# Altium project LPCB235__RLOOP__FCU.PrjPCB (part 4 of 7)

## Sheet LPCB235 - SPI UART - GROUP A.SchDoc
size A3; Address1: Factory 10; Address2: 9-13 Dingley Avenue, Dandeong, VICTORIA 3175, AUSTRALIA; DocumentNumber: 32; Revision: 1; SheetNumber: 32; SheetTotal: 37; Lockie__PCB_SUB_ASSEMBLY: SPI UARTS A; Lockie__PCB_ASSEMBLY: FCU PCB; Lockie__LDL: LPCB235; Lockie__PCB_DESCRIPTION: Flight Control Unit
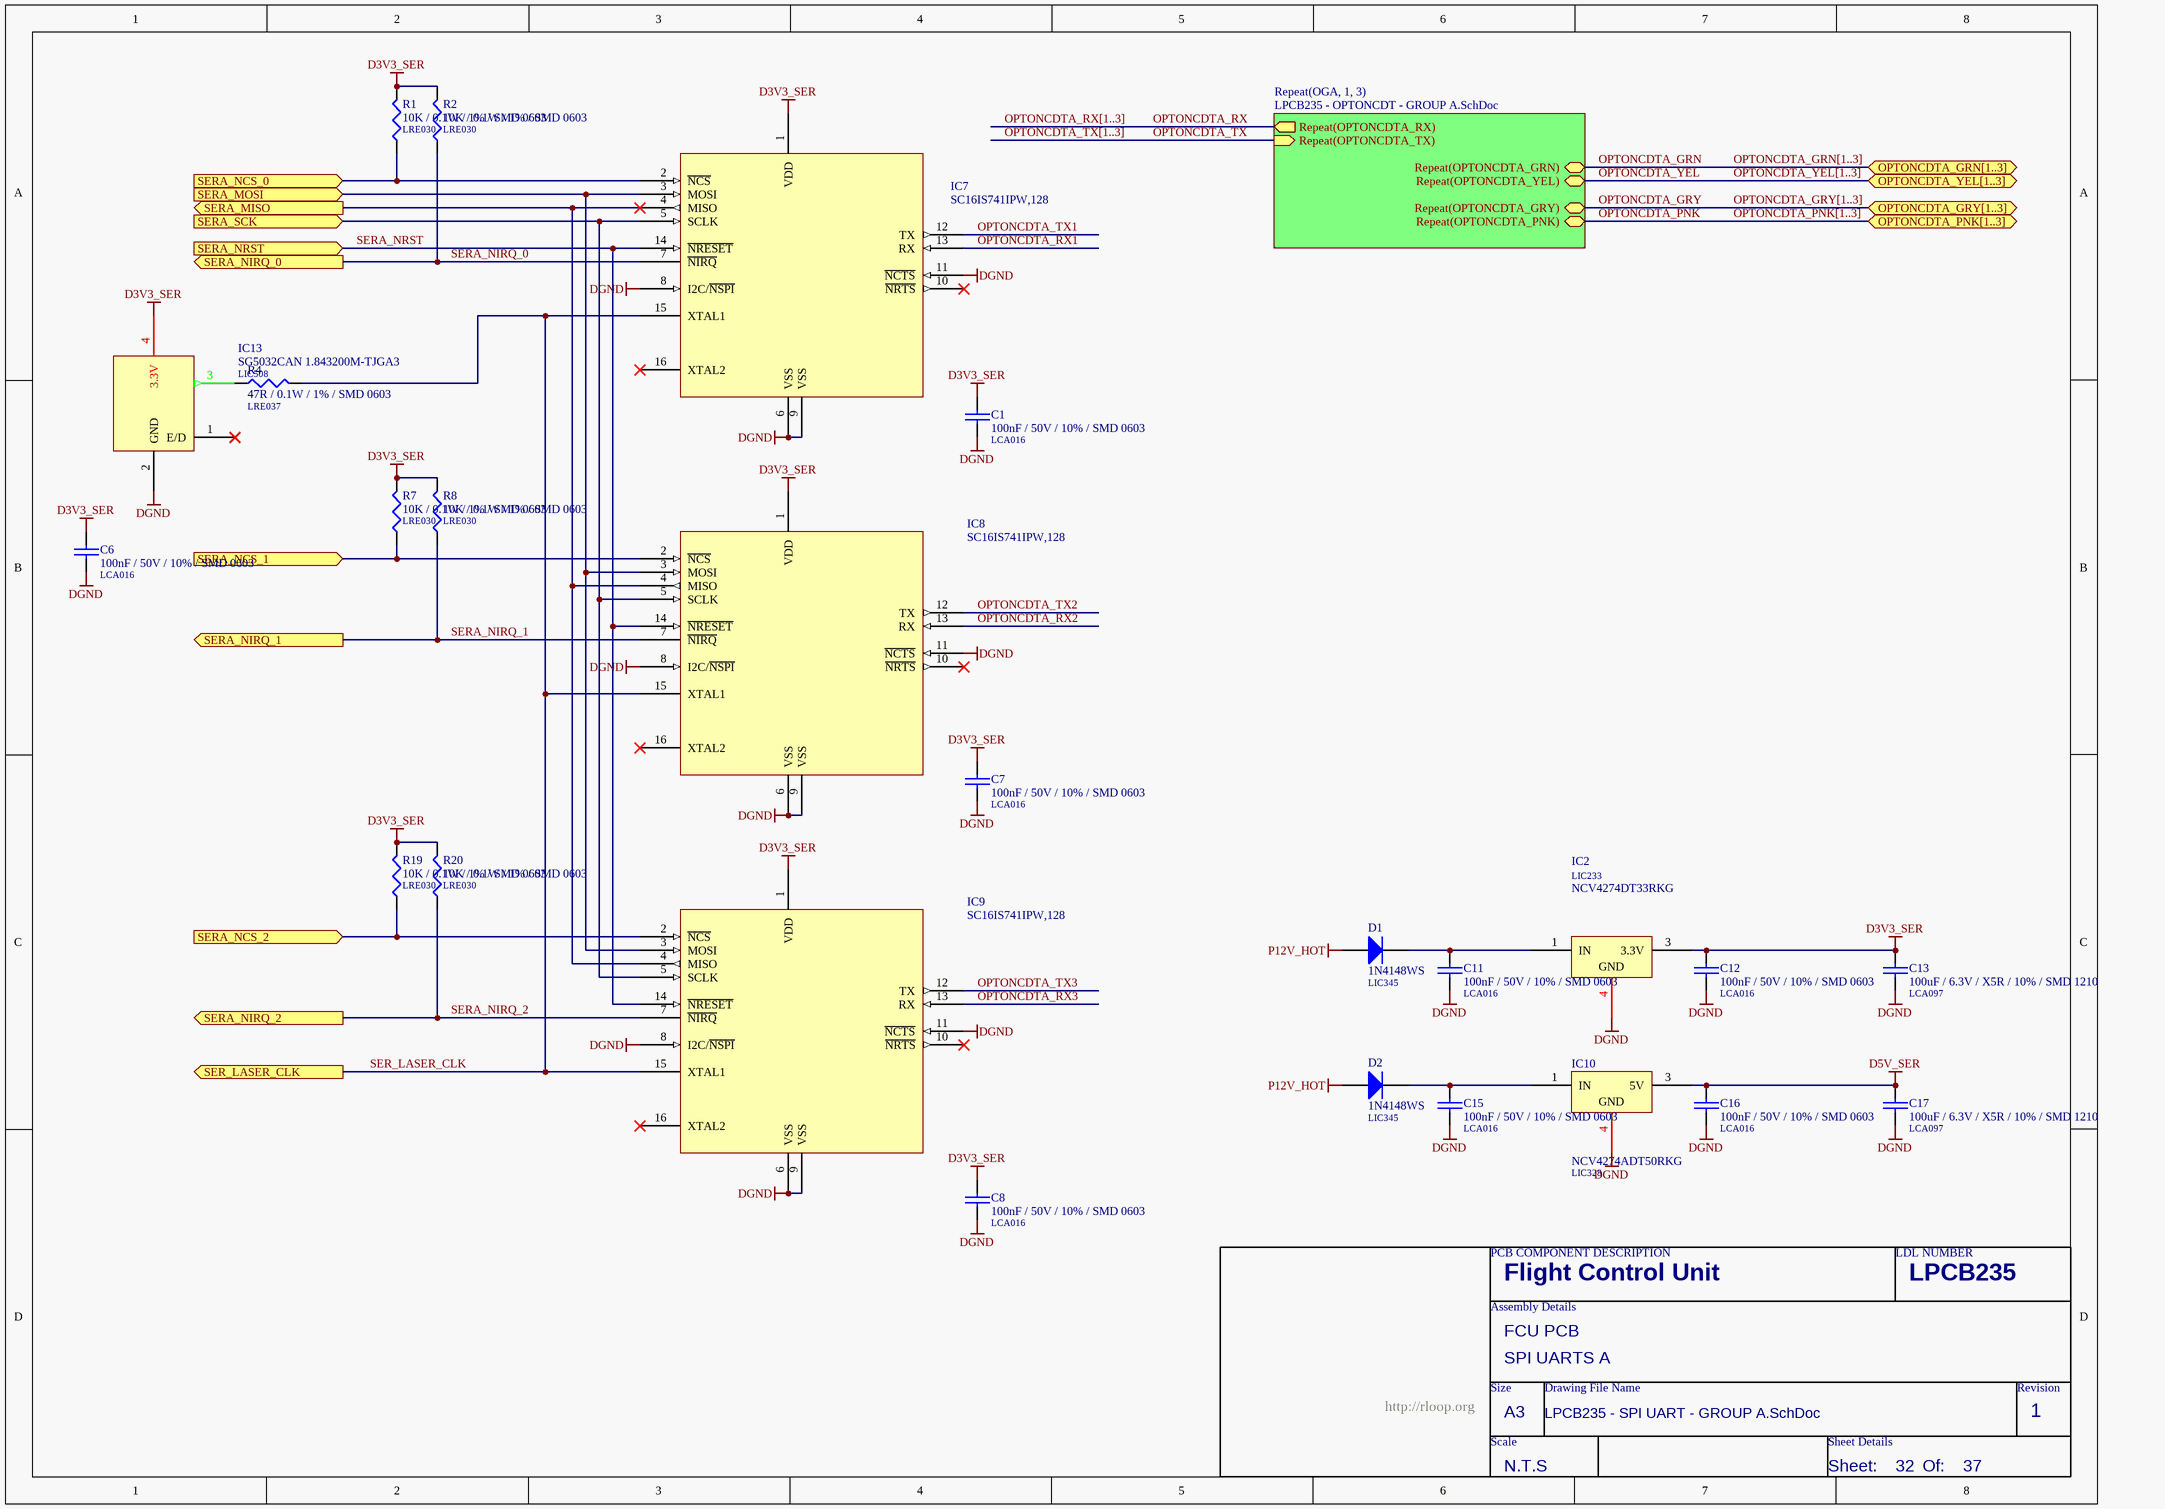
[diagram p18: LPCB235 - SPI UART - GROUP A.SchDoc]

### Parts
C1  100nF / 50V / 10% / SMD 0603  LDL_NUMBER: LCA016  [LFP011__CC1608-0603-IPC7351_B]
C6  100nF / 50V / 10% / SMD 0603  LDL_NUMBER: LCA016  [LFP011__CC1608-0603-IPC7351_B]
C7  100nF / 50V / 10% / SMD 0603  LDL_NUMBER: LCA016  [LFP011__CC1608-0603-IPC7351_B]
C8  100nF / 50V / 10% / SMD 0603  LDL_NUMBER: LCA016  [LFP011__CC1608-0603-IPC7351_B]
C11  100nF / 50V / 10% / SMD 0603  LDL_NUMBER: LCA016  [LFP011__CC1608-0603-IPC7351_B]
C12  100nF / 50V / 10% / SMD 0603  LDL_NUMBER: LCA016  [LFP011__CC1608-0603-IPC7351_B]
C13  100uF / 6.3V / X5R / 10% / SMD 1210  LDL_NUMBER: LCA097  [LFP013__CC3225-1210-IPC7351_B]
C15  100nF / 50V / 10% / SMD 0603  LDL_NUMBER: LCA016  [LFP011__CC1608-0603-IPC7351_B]
C16  100nF / 50V / 10% / SMD 0603  LDL_NUMBER: LCA016  [LFP011__CC1608-0603-IPC7351_B]
C17  100uF / 6.3V / X5R / 10% / SMD 1210  LDL_NUMBER: LCA097  [LFP013__CC3225-1210-IPC7351_B]
D1  1N4148WS  LDL_NUMBER: LIC345  [LFP001__SOD-323F]
D2  1N4148WS  LDL_NUMBER: LIC345  [LFP001__SOD-323F]
IC2  NCV4274DT33RKG  LDL_NUMBER: LIC233  [LFP019__369A-13]
IC7  SC16IS741IPW,128  [LFP049__TSSOP-16]
IC8  SC16IS741IPW,128  [LFP049__TSSOP-16]
IC9  SC16IS741IPW,128  [LFP049__TSSOP-16]
IC10  NCV4274ADT50RKG  LDL_NUMBER: LIC328  [LFP019__369A-13]
IC13  SG5032CAN 1.843200M-TJGA3  LDL_NUMBER: LIC508  [LFP072__ASFLMB]
R1  10K / 0.1W / 1% / SMD 0603  LDL_NUMBER: LRE030  [LFP020__CR1608-0603-IPC7351_B]
R2  10K / 0.1W / 1% / SMD 0603  LDL_NUMBER: LRE030  [LFP020__CR1608-0603-IPC7351_B]
R4  47R / 0.1W / 1% / SMD 0603  LDL_NUMBER: LRE037  [LFP020__CR1608-0603-IPC7351_B]
R7  10K / 0.1W / 1% / SMD 0603  LDL_NUMBER: LRE030  [LFP020__CR1608-0603-IPC7351_B]
R8  10K / 0.1W / 1% / SMD 0603  LDL_NUMBER: LRE030  [LFP020__CR1608-0603-IPC7351_B]
R19  10K / 0.1W / 1% / SMD 0603  LDL_NUMBER: LRE030  [LFP020__CR1608-0603-IPC7351_B]
R20  10K / 0.1W / 1% / SMD 0603  LDL_NUMBER: LRE030  [LFP020__CR1608-0603-IPC7351_B]

### Sub-sheets
Repeat(OGA, 1, 3) = LPCB235 - OPTONCDT - GROUP A.SchDoc: Repeat(OPTONCDTA_GRN) (bidir), Repeat(OPTONCDTA_YEL) (bidir), Repeat(OPTONCDTA_GRY) (bidir), Repeat(OPTONCDTA_PNK) (bidir), Repeat(OPTONCDTA_RX) (out), Repeat(OPTONCDTA_TX) (in)

### Ports
OPTONCDTA_GRN[1..3] (bidir), OPTONCDTA_GRY[1..3] (bidir), OPTONCDTA_PNK[1..3] (bidir), OPTONCDTA_YEL[1..3] (bidir), SER_LASER_CLK (out), SERA_MISO (out), SERA_MOSI (in), SERA_NCS_0 (in), SERA_NCS_1 (in), SERA_NCS_2 (in), SERA_NIRQ_0 (out), SERA_NIRQ_1 (out), SERA_NIRQ_2 (out), SERA_NRST (in), SERA_SCK (in)

### Nets
D3V3_SER: C1.1 C6.1 C7.1 C8.1 C12.1 C13.1 IC2.3(3.3V) IC7.1(VDD) IC8.1(VDD) IC9.1(VDD) IC13.4(3.3V) R1.2 R2.2 R7.2 R8.2 R19.2 R20.2
D5V_SER: C16.1 C17.1 IC10.3(5V)
DGND: C1.2 C6.2 C7.2 C8.2 C11.2 C12.2 C13.2 C15.2 C16.2 C17.2 IC2.4(GND) IC7.6(VSS) IC7.8(I2C/~{NSPI}) IC7.9(VSS) IC7.11(~{NCTS}) IC8.6(VSS) IC8.8(I2C/~{NSPI}) IC8.9(VSS) IC8.11(~{NCTS}) IC9.6(VSS) IC9.8(I2C/~{NSPI}) IC9.9(VSS) IC9.11(~{NCTS}) IC10.4(ADJ) IC13.2(GND)
P12V_HOT: D1.2(A) D2.2(A)
OPTONCDTA_GRN: sheet Repeat(OGA, 1, 3)/Repeat(OPTONCDTA_GRN)
OPTONCDTA_GRY: sheet Repeat(OGA, 1, 3)/Repeat(OPTONCDTA_GRY)
OPTONCDTA_PNK: sheet Repeat(OGA, 1, 3)/Repeat(OPTONCDTA_PNK)
OPTONCDTA_RX: sheet Repeat(OGA, 1, 3)/Repeat(OPTONCDTA_RX)
OPTONCDTA_RX1: IC7.13(RX)
OPTONCDTA_RX2: IC8.13(RX)
OPTONCDTA_RX3: IC9.13(RX)
OPTONCDTA_TX: sheet Repeat(OGA, 1, 3)/Repeat(OPTONCDTA_TX)
OPTONCDTA_TX1: IC7.12(TX)
OPTONCDTA_TX2: IC8.12(TX)
OPTONCDTA_TX3: IC9.12(TX)
OPTONCDTA_YEL: sheet Repeat(OGA, 1, 3)/Repeat(OPTONCDTA_YEL)
SER_LASER_CLK: IC7.15(XTAL1) IC8.15(XTAL1) IC9.15(XTAL1) R4.2 ; port SER_LASER_CLK
SERA_MISO: IC7.4(MISO) IC8.4(MISO) IC9.4(MISO) ; port SERA_MISO
SERA_MOSI: IC7.3(MOSI) IC8.3(MOSI) IC9.3(MOSI) ; port SERA_MOSI
SERA_NCS_0: IC7.2(~{NCS}) R1.1 ; port SERA_NCS_0
SERA_NCS_1: IC8.2(~{NCS}) R7.1 ; port SERA_NCS_1
SERA_NCS_2: IC9.2(~{NCS}) R19.1 ; port SERA_NCS_2
SERA_NIRQ_0: IC7.7(~{NIRQ}) R2.1 ; port SERA_NIRQ_0
SERA_NIRQ_1: IC8.7(~{NIRQ}) R8.1 ; port SERA_NIRQ_1
SERA_NIRQ_2: IC9.7(~{NIRQ}) R20.1 ; port SERA_NIRQ_2
SERA_NRST: IC7.14(~{NRESET}) IC8.14(~{NRESET}) IC9.14(~{NRESET}) ; port SERA_NRST
SERA_SCK: IC7.5(SCLK) IC8.5(SCLK) IC9.5(SCLK) ; port SERA_SCK
NetC11_1: C11.1 D1.1(K) IC2.1(IN)
NetC15_1: C15.1 D2.1(K) IC10.1(IN)
NetIC13_3: IC13.3(OUT) R4.1

Not connected (* = marked no-connect by the designer): IC7 10(~{NRTS})* 16(XTAL2)*; IC8 10(~{NRTS})* 16(XTAL2)*; IC9 10(~{NRTS})* 16(XTAL2)*; IC13 1(E/D)*

### Buses and harness runs
bus OPTONCDTA_GRN[1..3] = port OPTONCDTA_GRN[1..3]
bus OPTONCDTA_GRY[1..3] = port OPTONCDTA_GRY[1..3]
bus OPTONCDTA_PNK[1..3] = port OPTONCDTA_PNK[1..3]
bus OPTONCDTA_RX[1..3]
bus OPTONCDTA_TX[1..3]
bus OPTONCDTA_YEL[1..3] = port OPTONCDTA_YEL[1..3]

### Notes on the sheet
- PCB COMPONENT DESCRIPTION
- LDL NUMBER
- Assembly Details
- Size
- Drawing File Name
- Revision
- http://rloop.org
- Scale
- A3
- Sheet Details
- N.T.S
- Sheet:
- Of:
- (in symbol NCV4274ADT50RKG) GND

### Library data of the parts
C1 C6-C8 C11 C15 = 100nF / 50V / 10% / SMD 0603: as C5 on sheet LPCB235 - CAN Interface; FMEDA__FUNCTION_IN_SYSTEM: *; FMEDA__OPERATING__VOLTAGE_TYP: 3.3
C12 C16 = 100nF / 50V / 10% / SMD 0603: Capacitor, Ceramic Chip, 100nF (0.1uF), 50V, 5%, SMD 0603 [LCA016]; Value: 100n; FMEDA__OPERATING__TEMP_MAX: 50; FMEDA__OPERATING__TEMP_TYP: 27; FMEDA__OPERATING__TEMP_MIN: -20; FMEDA__OPERATING__VOLTAGE_MAX: 3.3; FMEDA__OPERATING__VOLTAGE_MIN: 0; FMEDA__CHANNEL: COM; FMEDA__FUNCTION_IN_SYSTEM: *; FMEDA__OPERATING__VOLTAGE_TYP: 3.3
C13 C17 = 100uF / 6.3V / X5R / 10% / SMD 1210: Capacitor, Ceramic Chip, 100uF, 6.3V, X5R, 20%, SMD 1210 [LCA097]; Value: 100u; FMEDA__FUNCTION_IN_SYSTEM: ACCEL PSU OUT FILTER; FMEDA__OPERATING__TEMP_MAX: 50; FMEDA__OPERATING__TEMP_TYP: 27; FMEDA__OPERATING__TEMP_MIN: -20; FMEDA__OPERATING__VOLTAGE_MAX: 3.3; FMEDA__OPERATING__VOLTAGE_MIN: 0; FMEDA__CHANNEL: COM; FMEDA__OPERATING__VOLTAGE_TYP: 3.3
D1 D2 = 1N4148WS: Diode, Small Signal, SMD SOD-323F [LIC345]; FMEDA__FUNCTION_IN_SYSTEM: ACCEL PSU INPUT DIODE; FMEDA__OPERATING__TEMP_MAX: 50; FMEDA__OPERATING__TEMP_MIN: -20; FMEDA__OPERATING__TEMP_TYP: 27; FMEDA__OPERATING__VOLTAGE_MAX: 0; FMEDA__CHANNEL: COM; FMEDA__OPERATING__VOLTAGE_MIN: 0; FMEDA__OPERATING__VOLTAGE_TYP: 0; FMEDA__OPERATING__CURRENT_MAX: 0; FMEDA__OPERATING__CURRENT_MIN: 0; FMEDA__OPERATING__CURRENT_TYP: 0
IC2 = NCV4274DT33RKG: IC, Voltage Regulator, 400mA, 3.3V LDO, SMD DPAK [LIC233]; FMEDA__OPERATING__OUTPUT_CURRENT_MIN: 0; FMEDA__OPERATING__TEMP_MAX: 50; FMEDA__OPERATING__TEMP_MIN: -20; FMEDA__OPERATING__TEMP_TYP: 27; VALUE: 0; Note: Obey Thermal Design Rules; FMEDA__FUNCTION_IN_SYSTEM: ACCEL PSU; FMEDA__CHANNEL: COM; FMEDA__OPERATING__OUTPUT_CURRENT_TYP: 0; FMEDA__OPERATING__VOLTAGE_MAX: 0; FMEDA__OPERATING__VOLTAGE_MIN: 0; FMEDA__OPERATING__VOLTAGE_TYP: 0
IC7-IC9 = SC16IS741IPW,128: as IC11 on sheet LPCB235 - SPI UART - GROUP B; FMEDA__FUNCTION_IN_SYSTEM: *
IC10 = NCV4274ADT50RKG: IC, Voltage Regulator, 400mA, 5V LDO, SMD DPAK [LIC328]; FMEDA__OPERATING__OUTPUT_CURRENT_MIN: 0; FMEDA__OPERATING__TEMP_MAX: 50; FMEDA__OPERATING__TEMP_MIN: -20; FMEDA__OPERATING__TEMP_TYP: 27; VALUE: 0; Note: Obey Thermal Design Rules; FMEDA__CHANNEL: COM; FMEDA__OPERATING__OUTPUT_CURRENT_TYP: 0; FMEDA__OPERATING__VOLTAGE_MAX: 0; FMEDA__OPERATING__VOLTAGE_MIN: 0; FMEDA__OPERATING__VOLTAGE_TYP: 0; FMEDA__FUNCTION_IN_SYSTEM: *
IC13 = SG5032CAN 1.843200M-TJGA3: IC, Oscillator Module, 1.8432MHz, 3.3V, SMD [LIC508]; FMEDA__OPERATING__TEMP_MAX: 50; FMEDA__OPERATING__TEMP_MIN: -20; FMEDA__OPERATING__TEMP_TYP: 27; FMEDA__OPERATING__VOLTAGE_MAX: 3.3; FMEDA__OPERATING__VOLTAGE_MIN: 0; FMEDA__CHANNEL: COM; FMEDA__OPERATING__VOLTAGE_TYP: 3.3; FMEDA__FUNCTION_IN_SYSTEM: *
R1 R2 R7 R8 R19 R20 = 10K / 0.1W / 1% / SMD 0603: as R12 on sheet LPCB235 - RM48 - MAIN; Value: 10K; FMEDA__OPERATING__POWER_MIN: 0; FMEDA__OPERATING__VOLTAGE_MAX: 0; FMEDA__OPERATING__VOLTAGE_MIN: 0; FMEDA__OPERATING__VOLTAGE_TYP: 0; FMEDA__FUNCTION_IN_SYSTEM: *
R4 = 47R / 0.1W / 1% / SMD 0603: as R13 on sheet LPCB235 - RM48 - MAIN; FMEDA__OPERATING__POWER_MIN: 0; FMEDA__OPERATING__VOLTAGE_MAX: 0; FMEDA__OPERATING__VOLTAGE_MIN: 0; FMEDA__OPERATING__VOLTAGE_TYP: 0; FMEDA__FUNCTION_IN_SYSTEM: *

## Sheet LPCB235 - OPTONCDT - GROUP A.SchDoc
size A3; Address1: Factory 10; Address2: 9-13 Dingley Avenue, Dandeong, VICTORIA 3175, AUSTRALIA; DocumentNumber: 33; Revision: 1; SheetNumber: 33; SheetTotal: 37; Lockie__PCB_SUB_ASSEMBLY: OptoNCDT Group A; Lockie__PCB_ASSEMBLY: FCU PCB; Lockie__LDL: LPCB235; Lockie__PCB_DESCRIPTION: Flight Control Unit
Used 3 times, as channels U_LPCB235 - SPI UART - GROUP A/OGA1, U_LPCB235 - SPI UART - GROUP A/OGA2, U_LPCB235 - SPI UART - GROUP A/OGA3. Parts and nets are listed once, with the designators drawn on the sheet.
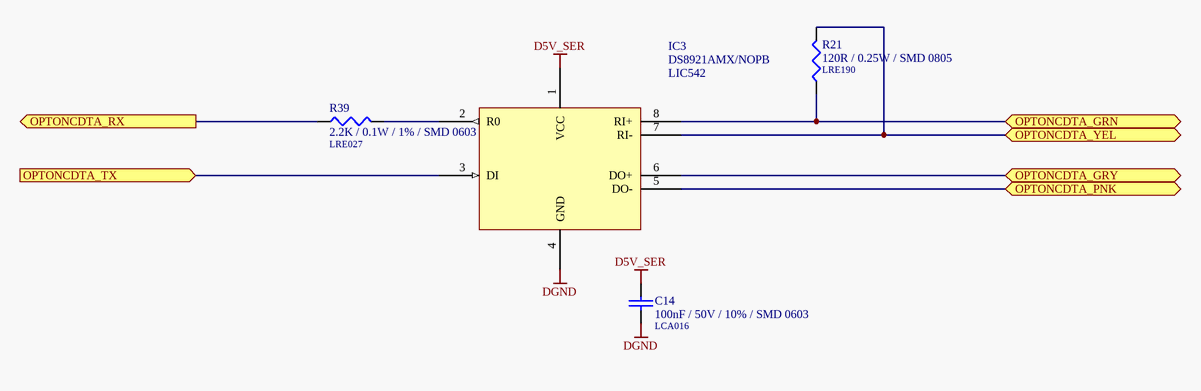
[diagram p19: LPCB235 - OPTONCDT - GROUP A.SchDoc]

### Parts
C14  100nF / 50V / 10% / SMD 0603  LDL_NUMBER: LCA016  [LFP011__CC1608-0603-IPC7351_B]
IC3  DS8921AMX/NOPB  LDL_NUMBER: LIC542  [LFP069__R-8G]
R21  120R / 0.25W / SMD 0805  LDL_NUMBER: LRE190  [LFP029__CR2012-0805]
R39  2.2K / 0.1W / 1% / SMD 0603  LDL_NUMBER: LRE027  [LFP020__CR1608-0603-IPC7351_B]

### Ports
OPTONCDTA_GRN (bidir), OPTONCDTA_GRY (bidir), OPTONCDTA_PNK (bidir), OPTONCDTA_RX (out), OPTONCDTA_TX (in), OPTONCDTA_YEL (bidir)

### Nets
D5V_SER: C14.1 IC3.1(VCC)
DGND: C14.2 IC3.4(GND)
OPTONCDTA_GRN: IC3.8(RI+) R21.1 ; port OPTONCDTA_GRN
OPTONCDTA_GRY: IC3.6(DO+) ; port OPTONCDTA_GRY
OPTONCDTA_PNK: IC3.5(DO-) ; port OPTONCDTA_PNK
OPTONCDTA_RX: R39.1 ; port OPTONCDTA_RX
OPTONCDTA_TX: IC3.3(DI) ; port OPTONCDTA_TX
OPTONCDTA_YEL: IC3.7(RI-) R21.2 ; port OPTONCDTA_YEL
NetIC3_2: IC3.2(R0) R39.2

### Channels
U_LPCB235 - SPI UART - GROUP A/OGA1: designators end in _OGA1; ports OPTONCDTA_GRN=OPTONCDTA_GRN1 OPTONCDTA_GRY=OPTONCDTA_GRY1 OPTONCDTA_PNK=OPTONCDTA_PNK1 OPTONCDTA_RX=OPTONCDTA_RX1 OPTONCDTA_TX=OPTONCDTA_TX1 OPTONCDTA_YEL=OPTONCDTA_YEL1
U_LPCB235 - SPI UART - GROUP A/OGA2: designators end in _OGA2; ports OPTONCDTA_GRN=OPTONCDTA_GRN2 OPTONCDTA_GRY=OPTONCDTA_GRY2 OPTONCDTA_PNK=OPTONCDTA_PNK2 OPTONCDTA_RX=OPTONCDTA_RX2 OPTONCDTA_TX=OPTONCDTA_TX2 OPTONCDTA_YEL=OPTONCDTA_YEL2
U_LPCB235 - SPI UART - GROUP A/OGA3: designators end in _OGA3; ports OPTONCDTA_GRN=OPTONCDTA_GRN3 OPTONCDTA_GRY=OPTONCDTA_GRY3 OPTONCDTA_PNK=OPTONCDTA_PNK3 OPTONCDTA_RX=OPTONCDTA_RX3 OPTONCDTA_TX=OPTONCDTA_TX3 OPTONCDTA_YEL=OPTONCDTA_YEL3

### Notes on the sheet
- PCB COMPONENT DESCRIPTION
- LDL NUMBER
- Assembly Details
- Size
- Drawing File Name
- Revision
- http://rloop.org
- Scale
- A3
- Sheet Details
- N.T.S
- Sheet:
- Of:

### Library data of the parts
C14 = 100nF / 50V / 10% / SMD 0603: as C5 on sheet LPCB235 - CAN Interface; FMEDA__FUNCTION_IN_SYSTEM: *; FMEDA__OPERATING__VOLTAGE_TYP: 3.3
IC3 = DS8921AMX/NOPB: IC, RS422 Tx Rx, SMD SOIC 8
R21 = 120R / 0.25W / SMD 0805: as R62 on sheet LPCB235 - OPTONCDT - GROUP B; FMEDA__OPERATING__POWER_MIN: 0; FMEDA__OPERATING__VOLTAGE_MAX: 0; FMEDA__OPERATING__VOLTAGE_MIN: 0; FMEDA__FUNCTION_IN_SYSTEM: *
R39 = 2.2K / 0.1W / 1% / SMD 0603: as R41 on sheet LPCB235 - RM48 - 100BASET; VALUE: 2.2K; FMEDA__OPERATING__VOLTAGE_MAX: 0; FMEDA__OPERATING__POWER_MIN: 0; FMEDA__OPERATING__POWER_MAX: 0; FMEDA__FUNCTION_IN_SYSTEM: *; FMEDA__OPERATING__VOLTAGE_TYP: 0